# Altium schematic sheet Sheet1.SchDoc: STLINK Interface
size A4; SheetNumber: 1; SheetTotal: 1; Project_Name: STLINK Interface
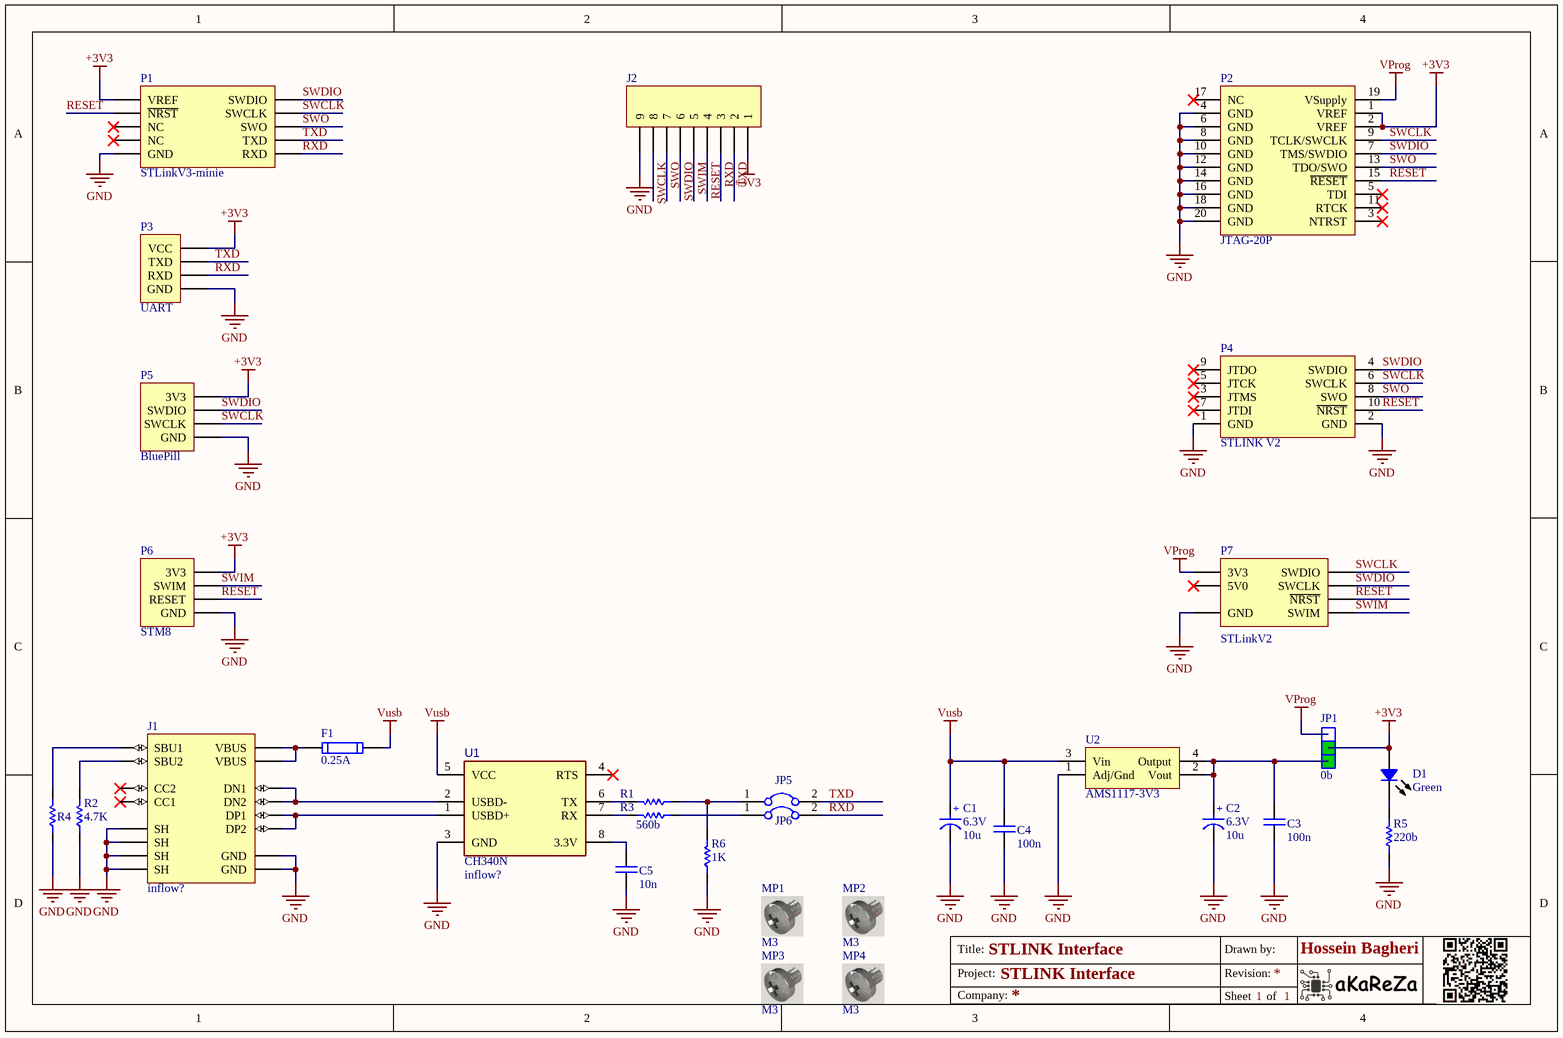
[diagram p0: Sheet1.SchDoc]

## Parts
C1  Rating: 6.3V  [SMT_C_Tantalum_B]  (hidden comment: 10u)
C2  Rating: 6.3V  [SMT_C_Tantalum_B]  (hidden comment: 10u)
C3  100n  [CAP 0805/2012]
C4  value 100n  [CAP 0805/2012]  (hidden comment: DS1307)
C5  10n  [CAP 0805/2012]
D1  Green  [LED 0805/2012 GREEN]
F1  0.25A  [1206_F]
J1  Inflow: inflow?  [USBC_SMD_16_USB4110 - Extended]  (hidden comment: 16b)
J2  9  [HDR_THT_9M_2.54mm]  (value not drawn)
JP1  0b  [jumper selector]
JP5  2'Pin  [Jumper Small - 2.54 - GRAY]  (value not drawn)
JP6  2'Pin  [Jumper Small - 2.54 - GRAY]  (value not drawn)
MP1  M3  [SCREW-M3]
MP2  M3  [SCREW-M3]
MP3  M3  [SCREW-M3]
MP4  M3  [SCREW-M3]
P1  STLinkV3-minie  [IDC2.54-10PIN]
P2  JTAG-20P  [BOX-HDR-10X2-2.54mm-S]
P3  UART  [MOLEX KK 0022272041]
P4  STLINK V2  [IDC2.54-10PIN]
P5  BluePill  [MOLEX KK 0022272041]
P6  STM8  [MOLEX KK 0022272041]
P7  STLinkV2  [IDC2.54-10PIN]
R1  560b  [RES 0805 (2012X06L)]  (value not drawn)
R2  4.7K  [RES 0805 (2012X06L)]
R3  560b  [RES 0805 (2012X06L)]
R4  4.7K  [RES 0805 (2012X06L)]  (value not drawn)
R5  220b  [RES 0805 (2012X06L)]
R6  1K  [RES 0805 (2012X06L)]
U1  Inflow: inflow?  [SO8_narrow_m]  (hidden comment: CH340N)
U2  AMS1117-3V3  [SOT223_M]

## Nets
+3V3: D1.1 J2.1 JP1.2 P1.10(VREF) P2.1(VREF) P2.2(VREF) P3.1(VCC) P5.1(3V3) P6.1(3V3)
GND: C1.2(-) C2.2(-) C3.2 C4.2 C5.2 J1.A1B12(GND) J1.B1A12(GND) J1.S1(SH) J1.S2(SH) J1.S3(SH) J1.S4(SH) J2.9 P1.2(GND) P2.4(GND) P2.6(GND) P2.8(GND) P2.10(GND) P2.12(GND) P2.14(GND) P2.16(GND) P2.18(GND) P2.20(GND) P3.4(GND) P4.1(GND) P4.2(GND) P5.4(GND) P6.3(GND) P7.5,6(GND) R2.1 R4.1 R5.1 R6.1 U1.3(GND) U2.1(Adj/Gnd)
VProg: JP1.3 P2.19(VSupply) P7.7,8(3V3)
Vusb: C1.1(+) C4.1 F1.2 U1.5(VCC) U2.3(Vin)
RESET: J2.4 P1.8(~{NRST}) P2.15(~{RESET}) P4.10(~{NRST}) P6.4(RESET) P7.1(~{NRST})
RXD: J2.3 JP6.2 P1.6(RXD) P3.3(RXD)
SWCLK: J2.8 P1.7(SWCLK) P2.9(TCLK/SWCLK) P4.6(SWCLK) P5.3(SWCLK) P7.4(SWDIO)
SWDIO: J2.6 P1.5(SWDIO) P2.7(TMS/SWDIO) P4.4(SWDIO) P5.2(SWDIO) P7.2(SWCLK)
SWIM: J2.5 P6.2(SWIM) P7.3(SWIM)
SWO: J2.7 P1.9(SWO) P2.13(TDO/SWO) P4.8(SWO)
TXD: J2.2 JP5.2 P1.4(TXD) P3.2(TXD)
NetC2_1: C2.1(+) C3.1 JP1.1 U2.2(Vout) U2.4(Output)
NetC5_1: C5.1 U1.8(3.3V)
NetD1_2: D1.2 R5.2
NetF1_1: F1.1 J1.A4B9(VBUS) J1.B4A9(VBUS)
NetJ1_A6: J1.A6(DP1) J1.B6(DP2) U1.1(USBD+)
NetJ1_A7: J1.A7(DN1) J1.B7(DN2) U1.2(USBD-)
NetJ1_A8: J1.A8(SBU1) R4.2
NetJ1_B8: J1.B8(SBU2) R2.2
NetJP5_1: JP5.1 R1.1 R6.2
NetJP6_1: JP6.1 R3.1
NetR1_2: R1.2 U1.6(TX)
NetR3_2: R3.2 U1.7(RX)

Not connected (* = marked no-connect by the designer): J1 A5(CC1)* B5(CC2)*; P1 1(NC)* 3(NC)*; P2 3(NTRST)* 5(TDI)* 11(RTCK)* 17(NC)*; P4 3(JTMS)* 5(JTCK)* 7(JTDI)* 9(JTDO)*; P7 9,10(5V0)*; U1 4(RTS)*

## Notes on the sheet
- Title:
- Project:
- Drawn by:
- Revision:
- Hossein Bagheri
- Company:
- Sheet
- of

## Library data of the parts
C1 C2 = Cap_Tantalum: Tantalum Capacitor,TAJ Series-SMD; Inflow: inflow?; Validation: Valid; Package: Package?; Type: Tantalum; Value: 10u
C3 = Cap_Multi_SMD_100nF_0805: Bipolar ceramic capacitor SMD; Inflow: inflow?; Type: MultiLayer; Rating: 50V; Validation: Valid; Package: 0805; Value: 100n
C4 C5 = Cap_Multi_SMD_100nF_0805: Bipolar ceramic capacitor SMD; Inflow: inflow?; Type: MultiLayer; Rating: 50V; Package: 0805
  C5: Value: 10n
D1 = Semi_LED_SMD: LED; Inflow: inflow?; Rating: Rating?; Validation: Valid; Package: Package?; Type: LED; Value: Green
F1 = Other_Elec_Fuse_SMD: Short circiut  protection; Inflow: 0.5A; Type: Fast; Rating: Rating?; Package: 1206; Value: 0.25A
J1 = Con_USB_C_16P: USB C Female Connector; Rating: Rating?; Validation: NT; Value: 16b; Package: SMD; Type: C
J2 = Con_MPH_9x1_V_THT_2.54: Header, single row, 9 pin; Inflow: 7152; Rating: Rating?; Validation: NT; Value: 9; Package: Package?; Type: Type?
JP1 = SW_Other_JSelector_THT: Jumper Selector; Rating: Rating?; Inflow: 5145; Validation: Valid; Package: Dip; Type: Selector; Value: 0b
JP5 JP6 = SW_Other_Jumper: Jumper; Rating: Rating?; Validation: Valid; Inflow: 5145; Value: 2'Pin; Package: Package?; Type: Type?
MP1-MP4 = Other_Mech_Screw: Board Screw With Spacer; Rating: Rating?; Inflow: 8243; Validation: Valid; Package: Package?; Type: Screw; Value: M3
P1 = Con_Prog_STLinkV3_SWD: STLINK-V3MINIE debugger/programmer IDC probe for STM32 microcontrollers; Rating: Rating?; Validation: NT; Inflow: 7119; Value: STLinkV3-minie; Package: Package?; Type: SWD
P2 = Con_Prog_JTAG_20: 20 Pin Standard JTAG Header For ARM JLINK; Rating: Rating?; Validation: NT; Inflow: 7134; Value: JTAG-20P; Package: Package?; Type: Type?
P3 = Con_UART: UART Connector; Rating: Rating?; Validation: NT; Inflow: 4528; Package: Package?; Type: Type?; Value: UART
P4 = Con_Prog_CheapProject: STLINK-V2 debugger/programmer IDC probe for STM32 microcontrollers; Rating: Rating?; Validation: NT; Inflow: 7119; Package: Package?; Type: SWD; Value: STLINK V2
P5 = Con_Prog_BluePill: Serial Wire 4'pin; Rating: Rating?; Validation: NT; Inflow: 4528; Package: Package?; Type: Type?; Value: BluePill
P6 = Con_Prog_STM8: STM8 Programmer Connector; Rating: Rating?; Validation: NT; Inflow: 4528; Package: Package?; Type: Type?; Value: STM8
P7 = Con_Prog_STLinkV2: STLINK-V2 debugger/programmer IDC probe for STM32 microcontrollers; Rating: Rating?; Validation: NT; Inflow: 7119; Value: STLinkV2; Package: Package?; Type: SWD
R1-R4 R6 = Res_SMD_0805: Resistor; Inflow: inflow?; Rating: 0.125W; Package: 0805; Type: 10%
  R1 R3: Value: 560b
  R2 R4: Value: 4.7K
  R6: Value: 1K
R5 = Res_SMD_0805: Resistor; Inflow: inflow?; Rating: 0.125W; Validation: Valid; Package: 0805; Type: 10%; Value: 220b
U1 = IC_Converter_CH340N: TTL To USB Chip; Rating: Rating?; Type: USB to TTL; Package: SO-8; Value: CH340N
U2 = IC_Reg_AMS1117_3.3: 1'A Positive voltage regulator; Rating: 1A; Validation: Valid; Inflow: 5217; Type: LDO; Package: SOT223; Value: AMS1117-3V3